# Altium schematic sheet Sheet1.SchDoc
size A4; SheetNumber: 1; SheetTotal: 1
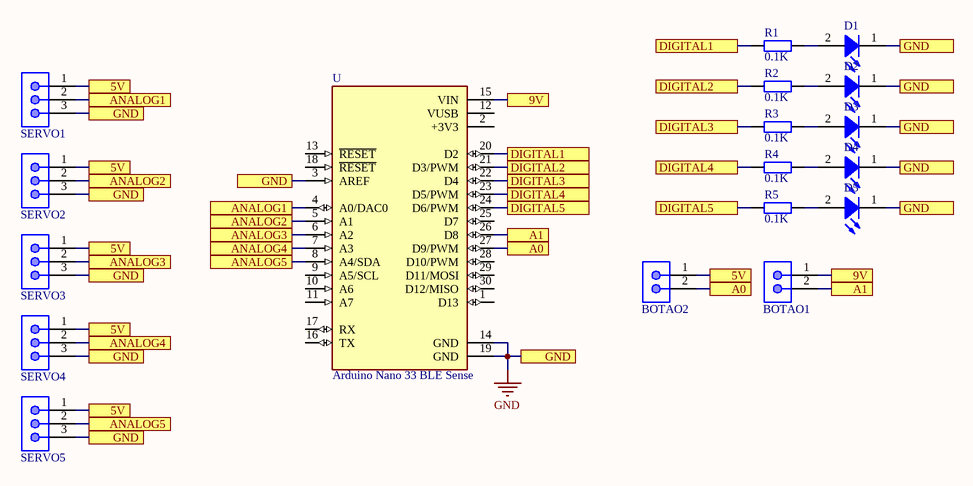
[diagram p0: Sheet1.SchDoc]

## Parts
BOTAO1  61300211121  [61300211121]  (value not drawn)
BOTAO2  61300211121  [61300211121]  (value not drawn)
D1  Blue, 3.2V, 40deg  [LED GREEN 3MM]  (value not drawn)
D2  Blue, 3.2V, 40deg  [LED GREEN 3MM]  (value not drawn)
D3  Blue, 3.2V, 40deg  [LED GREEN 3MM]  (value not drawn)
D4  Blue, 3.2V, 40deg  [LED GREEN 3MM]  (value not drawn)
D5  Blue, 3.2V, 40deg  [LED GREEN 3MM]  (value not drawn)
R1  value 0.1K  [RES AXIAL-0.4]  (hidden comment: Res)
R2  value 0.1K  [RES AXIAL-0.4]  (hidden comment: Res)
R3  value 0.1K  [RES AXIAL-0.4]  (hidden comment: Res)
R4  value 0.1K  [RES AXIAL-0.4]  (hidden comment: Res)
R5  value 0.1K  [RES AXIAL-0.4]  (hidden comment: Res)
SERVO1  61300311121  [61300311121]  (value not drawn)
SERVO2  61300311121  [61300311121]  (value not drawn)
SERVO3  61300311121  [61300311121]  (value not drawn)
SERVO4  61300311121  [61300311121]  (value not drawn)
SERVO5  61300311121  [61300311121]  (value not drawn)
U  Arduino Nano 33 BLE Sense  [MODULE_ABX00027]

## Ports
5V (see Sheet1[2A], Sheet1[2B], Sheet1[2C]), 5V (see Sheet1[2A], Sheet1[2B], Sheet1[2C], Sheet1[3B]), 5V (see Sheet1[2A], Sheet1[2B], Sheet1[3B]), 5V (see Sheet1[2B], Sheet1[2C], Sheet1[3B]), 9V (see Sheet1[3A]), 9V (see Sheet1[4B]), A0 (see Sheet1[3B]), A1 (see Sheet1[3B]), A1 (see Sheet1[4B]), ANALOG1 (see Sheet1[2A]), ANALOG1 (see Sheet1[2B]), ANALOG2 (see Sheet1[2B]), ANALOG3 (see Sheet1[2B]), ANALOG4 (see Sheet1[2B]), ANALOG5 (see Sheet1[2B]), ANALOG5 (see Sheet1[2C]), DIGITAL1 (see Sheet1[3A]), DIGITAL1 (see Sheet1[3B]), DIGITAL2 (see Sheet1[3A]), DIGITAL2 (see Sheet1[3B]), DIGITAL3 (see Sheet1[3A]), DIGITAL3 (see Sheet1[3B]), DIGITAL4 (see Sheet1[3B]), DIGITAL5 (see Sheet1[3B]), GND (see Sheet1[2A], Sheet1[2B], Sheet1[2C], Sheet1[3B], Sheet1[4A], Sheet1[4B]), GND (see Sheet1[2A], Sheet1[2B], Sheet1[2C], Sheet1[4A], Sheet1[4B]), GND (see Sheet1[2A], Sheet1[2B], Sheet1[3B], Sheet1[4A], Sheet1[4B]), GND (see Sheet1[2B], Sheet1[2C], Sheet1[3B], Sheet1[4A], Sheet1[4B])

## Nets
GND: D1.1(K) D2.1(K) D3.1(K) D4.1(K) D5.1(K) SERVO1.3 SERVO2.3 SERVO3.3 SERVO4.3 SERVO5.3 U.3(AREF) U.14(GND) U.19(GND) ; port GND
5V: BOTAO2.1 SERVO1.1 SERVO2.1 SERVO3.1 SERVO4.1 SERVO5.1 ; port 5V
9V: BOTAO1.1 U.15(VIN) ; port 9V
A0: BOTAO2.2 U.27(D9/PWM) ; port A0
A1: BOTAO1.2 U.26(D8) ; port A1
ANALOG1: SERVO1.2 U.4(A0/DAC0) ; port ANALOG1
ANALOG2: SERVO2.2 U.5(A1) ; port ANALOG2
ANALOG3: SERVO3.2 U.6(A2) ; port ANALOG3
ANALOG4: SERVO4.2 U.7(A3) ; port ANALOG4
ANALOG5: SERVO5.2 U.8(A4/SDA) ; port ANALOG5
DIGITAL1: R1.1 U.20(D2) ; port DIGITAL1
DIGITAL2: R2.1 U.21(D3/PWM) ; port DIGITAL2
DIGITAL3: R3.1 U.22(D4) ; port DIGITAL3
DIGITAL4: R4.1 U.23(D5/PWM) ; port DIGITAL4
DIGITAL5: R5.1 U.24(D6/PWM) ; port DIGITAL5
NetD1_2: D1.2(A) R1.2
NetD2_2: D2.2(A) R2.2
NetD3_2: D3.2(A) R3.2
NetD4_2: D4.2(A) R4.2
NetD5_2: D5.2(A) R5.2

Not connected (* = marked no-connect by the designer): U 1(D13) 2(+3V3) 9(A5/SCL) 10(A6) 11(A7) 12(VUSB) 13(~{RESET}) 16(TX) 17(RX) 18(~{RESET}) 25(D7) 28(D10/PWM) 29(D11/MOSI) 30(D12/MISO)

## Library data of the parts
BOTAO1 BOTAO2 = 61300211121: WR-PHD Pin Header, THT, pitch 2.54mm, Single Row, Vertical, 2pin; Pin Number: 2; Gender: Male; Rated Current: 3A; Working Voltage: 250VAC; Withstanding Voltage: 500VAC; Contact Resistance: 20mOhm; ComponentLink1Description: Manufacturer; ComponentLink1URL: http://www.we-online.de; ComponentLink2Description: Datasheet; ComponentLink2URL: https://katalog.we-online.de/em/datasheet/6130xx11121.pdf; Part Number: 61300211121; Published Date: June 2019; Publisher: Wurth Elektronik; Pitch: 2.54mm; Operating Temperature: -40 to +105degC; Mounting Technology: THT; Packaging: Bag; Row Number: Single; Orientation: Vertical
D1-D5 = LED: LED WL-TMRC THT Mono-color Round; Part Number: 151051BS04000; Luminous Intensity: 500mcd; Dominant Wavelength: 470nm; Peak Wavelength: 465nm; Chip Technology: GaN; ComponentLink1Description: Manufacturer; ComponentLink1URL: http://www.we-online.de; ComponentLink2Description: Datasheet; ComponentLink2URL: https://katalog.we-online.de/led/datasheet/151051BS04000.pdf; Emitting Color: Blue; Operating Temperature: -40 to +85degC; Mounting Technology: THT; Forward Voltage: 3.2V; Packaging: Bulk; Published Date: October 2019; Publisher: Wurth Elektronik; Size: 5mm; Viewing Angle: 40deg
R1-R5 = Res: Resistor; Published: 8-Jun-2000; LatestRevisionDate: 17-Jul-2002; LatestRevisionNote: Re-released for DXP Platform.; PackageReference: AXIAL-0.4; Publisher: Altium Limited; PackageDescription: Axial Device, Thru-Hole; 2 Leads; 0.4 in Pin Spacing
SERVO1-SERVO5 = 61300311121: WR-PHD Pin Header, THT, pitch 2.54mm, Single Row, Vertical, 3pin; Pin Number: 3; Gender: Male; Rated Current: 3A; Working Voltage: 250VAC; Withstanding Voltage: 500VAC; Contact Resistance: 20mOhm; ComponentLink1Description: Manufacturer; ComponentLink1URL: http://www.we-online.de; ComponentLink2Description: Datasheet; ComponentLink2URL: https://katalog.we-online.de/em/datasheet/6130xx11121.pdf; Part Number: 61300311121; Published Date: June 2019; Publisher: Wurth Elektronik; Pitch: 2.54mm; Operating Temperature: -40 to +105degC; Mounting Technology: THT; Packaging: Bag; Row Number: Single; Orientation: Vertical
U = Arduino Nano 33 BLE Sense: ATSAMD21G18A Arduino Nano 33 IoT SAM D ARMÂ® CortexÂ®-M0 + MCU Ù‡ÛŒØ¦Øª Ù…Ø¯ÛŒØ±Ù‡ Ø§Ø±Ø²ÛŒØ§Ø¨ÛŒ Ø¬Ø§Ø³Ø§Ø²ÛŒ Ø´Ø¯Ù‡ 32 Ø¨ÛŒØªÛŒ; MP: ABX00027; Package: None; Availability: Unavailable; SnapEDA_Link: https://www.snapeda.com/parts/ABX00027/Arduino/view-part/3949339/?ref=snap; DigiKey-Purchase-URL: https://snapeda.com/shop?store=DigiKey&id=3949339; Value: *; MF: Arduino; Price: None; Mouser-Purchase-URL: https://snapeda.com/shop?store=Mouser&id=3949339